# EAGLE design xbee (EAGLE 6.5.0)
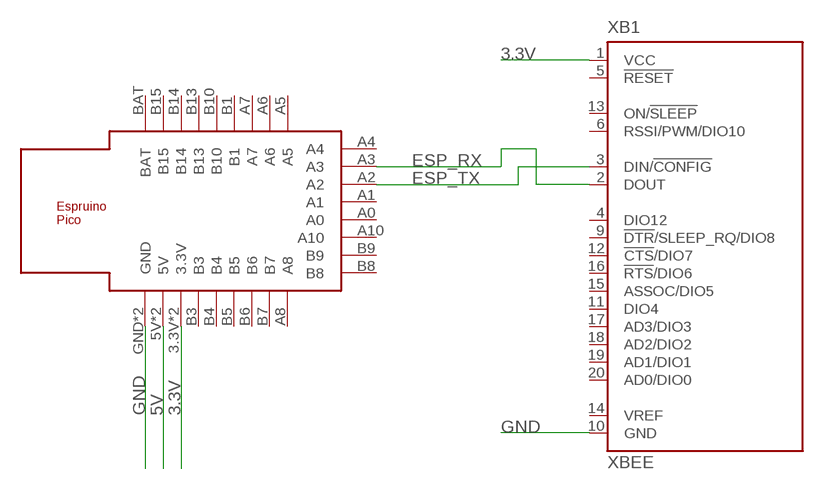
[diagram p0: schematic, sheet 1]

## Parts
U$1  ESPRUINO_PICO_PIN  [ESPRUINO_PICO_PIN]
XB1  XBEE  [XBEE]

## Nets
3.3V: U$1.3.3V U$1.3.3V_2(3.3V) XB1.1(VCC)
5V: U$1.5V U$1.5V_2(5V)
ESP_RX: U$1.A3 XB1.2(DOUT)
ESP_TX: U$1.A2 XB1.3(DIN/!CONFIG)
GND: U$1.GND U$1.GND_2(GND) XB1.10(GND)
Unconnected: U$1.A0 U$1.A1 U$1.A4 U$1.A5 U$1.A6 U$1.A7 U$1.A8 U$1.A10 U$1.B1 U$1.B3 U$1.B4 U$1.B5 U$1.B6 U$1.B7 U$1.B8 U$1.B9 U$1.B10 U$1.B13 U$1.B14 U$1.B15 U$1.BAT XB1.4(DIO12) XB1.5(!RESET) XB1.6(RSSI/PWM/DIO10) XB1.9(!DTR!/SLEEP_RQ/DIO8) XB1.11(DIO4) XB1.12(!CTS!/DIO7) XB1.13(ON/!SLEEP) XB1.14(VREF) XB1.15(ASSOC/DIO5) XB1.16(!RTS!/DIO6) XB1.17(AD3/DIO3) XB1.18(AD2/DIO2) XB1.19(AD1/DIO1) XB1.20(AD0/DIO0)

## Library data of the parts
U$1 = espruino_pico:ESPRUINO_PICO_PIN
XB1 = xbee:XBEE: XBee (TM) /XBee-PRO(TM) OEM RF Modules Source: MaxStream, Inc. xbee_productmanual.pdf; MPN: XBP24-Z7UIT-004; OC_FARNELL: 1751799; OC_NEWARK: 34R5507

## Net classes
0 default: width 0.305 mm

## Board
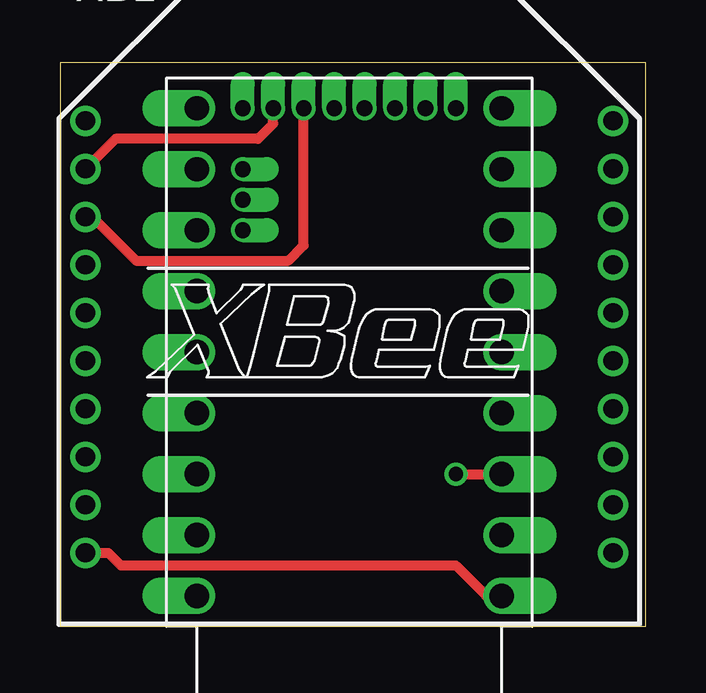
[diagram p1: board, top side]
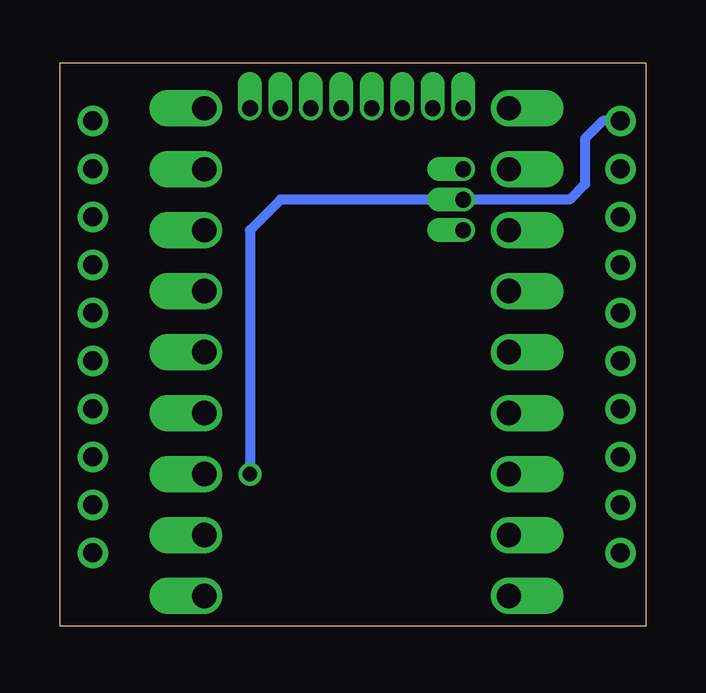
[diagram p2: board, bottom side, seen from below]

Size 24.43 x 23.48 mm. Coordinates in mm from the lower left corner, seen from the top.
Outline: 0,0 24.43,0 24.43,23.48 0,23.48 0,0
Copper layers (1*16): Top 0.0356mm / dielectric 1.5011mm / Bottom 0.0356mm
Design rules "oshpark": minimum track width 10mil, minimum drill 13mil, track to track 8mil, track to pad 6mil, pad to pad 6mil, via to via 6mil, smd to smd 6mil, copper to edge 15mil, drill to drill 6mil, minimum pad ring 7mil, minimum via ring 7mil, stop-mask expansion 4mil, vias tented up to drill 15mil, thermal gap 10mil

### Footprints (pad centres in the part's own frame; a part is rotated, then mirrored left to right if it is on the bottom)
ESPRUINO_PICO_PIN = drill 1.016 offset: 3.3V -8.89,-6.35; 5V -11.43,-6.35; A5 6.35,6.35; A6 3.81,6.35; A7 1.27,6.35; A8 6.35,-6.35; B1 -1.27,6.35; B3 -6.35,-6.35; B4 -3.81,-6.35; B5 -1.27,-6.35; B6 1.27,-6.35; B7 3.81,-6.35; B10 -3.81,6.35; B13 -6.35,6.35; B14 -8.89,6.35; B15 -11.43,6.35; BAT -13.97,6.35; GND -13.97,-6.35 | drill 0.65 pad 0.965 offset: 3.3V_2 2.54,4.445; 5V_2 1.27,4.445; A0 6.35,-0.635; A1 6.35,0.635; A2 6.35,1.905; A3 6.35,3.175; A4 6.35,4.445; A10 6.35,-1.905; B8 6.35,-4.445; B9 6.35,-3.175; GND_2 3.81,4.445
XBEE = drill 0.8 pad 1.27: 1 -11,9; 2 -11,7; 3 -11,5; 4 -11,3; 5 -11,1; 6 -11,-1; 7 -11,-3; 8 -11,-5; 9 -11,-7; 10 -11,-9; 11 11,-9; 12 11,-7; 13 11,-5; 14 11,-3; 15 11,-1; 16 11,1; 17 11,3; 18 11,5; 19 11,7; 20 11,9

### Placement (x,y rotation side)
U$1  12.06,15.24 90 top
XB1  12.06,12.06 0 top

### Tracks (layer width: path | path; a pad name or v marks a point on that pad's centre or on a via)
3.3V  (via drill 0.6)
  Top 0.406: v16.51,6.35 U$1.3.3V
  Bottom 0.406: XB1.1 1.79,21.07 2.54,20.32 2.54,18.41 3.17,17.78 U$1.3.3V_2 15.24,17.78 16.51,16.51 v16.51,6.35
ESP_RX
  Top 0.406: XB1.2 2.32,20.32 8.26,20.32 8.89,20.95 U$1.A3
ESP_TX
  Top 0.406: U$1.A2 10.16,15.88 9.53,15.24 3.17,15.24 1.35,17.07 XB1.3
GND
  Top 0.406: XB1.10 2.02,3.06 2.54,2.54 16.51,2.54 17.78,1.27 U$1.GND